# Altium schematic sheet 项目概述&修改记录.schdoc: =
size A4; Symbol: Sheet-Symbol_A4; Company: 嘉立创EDA; Version: V1.0; Page Size: A4; @Project Name: RK3568B2地瓜派; @Page Count: 26; @Update Date: 2025-09-11; @Create Date: 2025-09-11; @Schematic Name: Schematic1; @Page No: 1; @Page Name: 项目概述; Device: Sheet-Symbol_A4; Border: 1; Title Block Position: 3; Width: 1170; Height: 825; Region Start: 1; X Region Count: 6; Y Region Count: 4; Blade Width: 10; @Board Name: Board1; @Create Time: 22:14:44; @Update Time: 22:17:26; Organization: ORGANIZATION; Address1: ADDRESS 1; Address2: ADDRESS 2; Address3: ADDRESS 3; Address4: ADDRESS 4; SheetNumber: 1; SheetTotal: 28
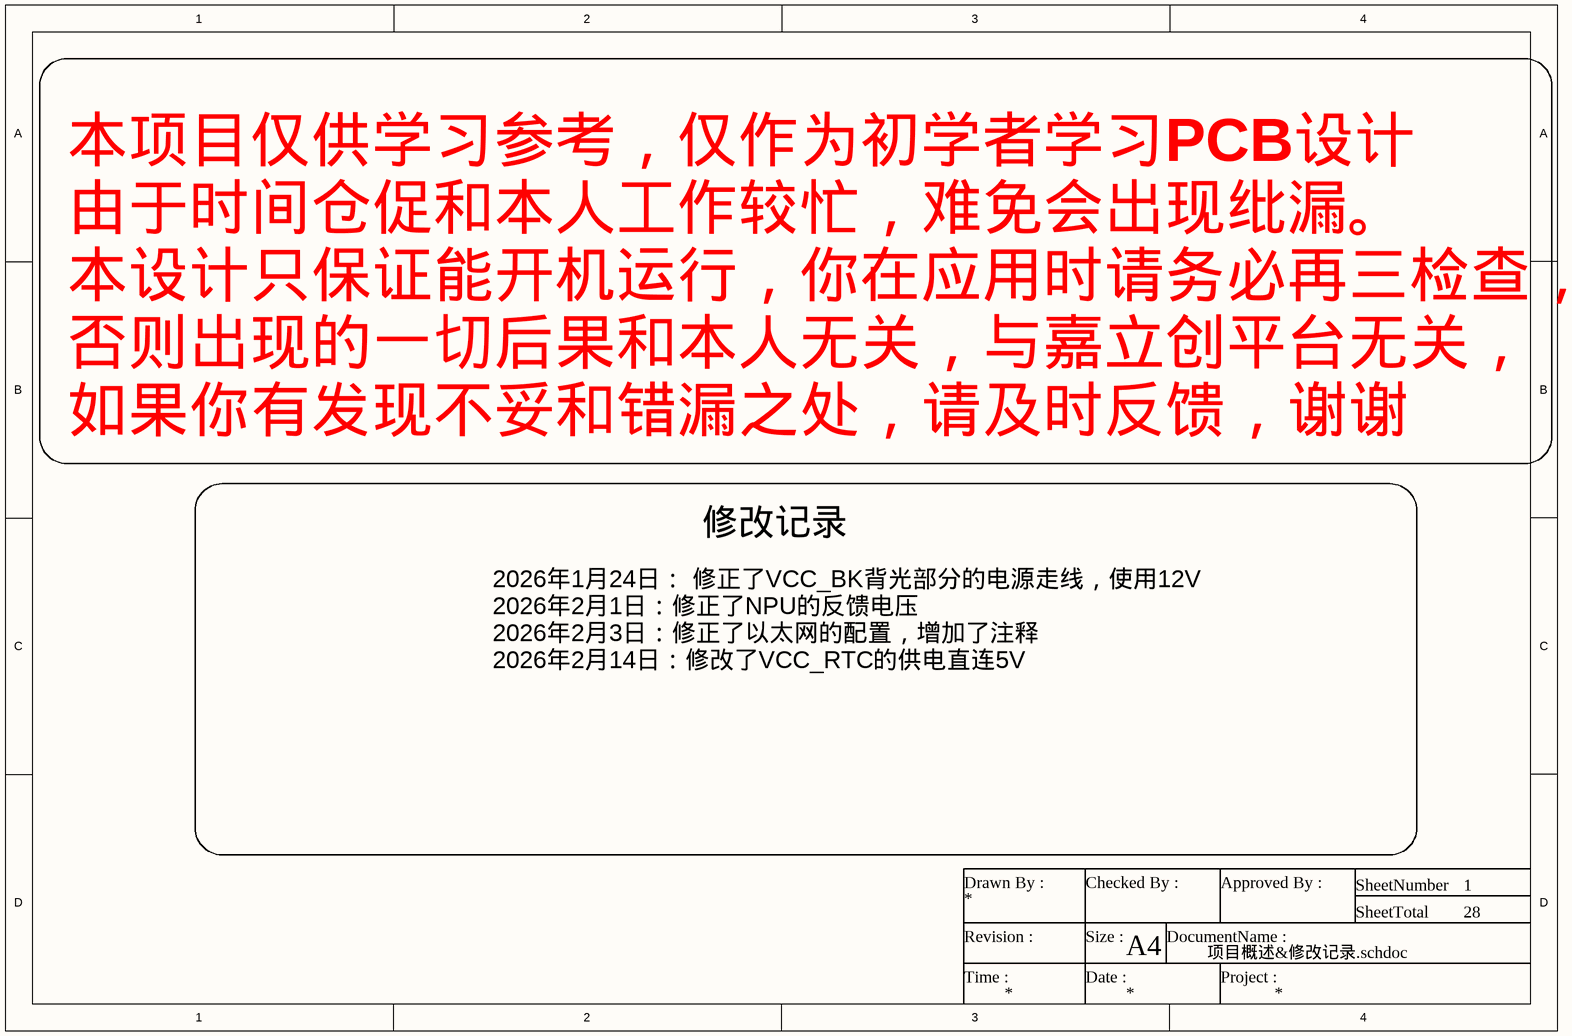
[diagram p0: 项目概述&修改记录.schdoc]

## Notes on the sheet
- 本项目仅供学习参考，仅作为初学者学习PCB设计
  由于时间仓促和本人工作较忙，难免会出现纰漏。
  本设计只保证能开机运行，你在应用时请务必再三检查，
  否则出现的一切后果和本人无关，与嘉立创平台无关，
  如果你有发现不妥和错漏之处，请及时反馈，谢谢
- 修改记录
- 2026年1月24日： 修正了VCC_BK背光部分的电源走线，使用12V
  2026年2月1日：修正了NPU的反馈电压
  2026年2月3日：修正了以太网的配置，增加了注释
  2026年2月14日：修改了VCC_RTC的供电直连5V
- Drawn By :
- Checked By :
- Approved By :
- SheetNumber
- SheetTotal
- Revision :
- Time :
- Size :
- Date :
- A4
- DocumentName :
- Project :